# EAGLE schematic pj8 (EAGLE 7.3.2)
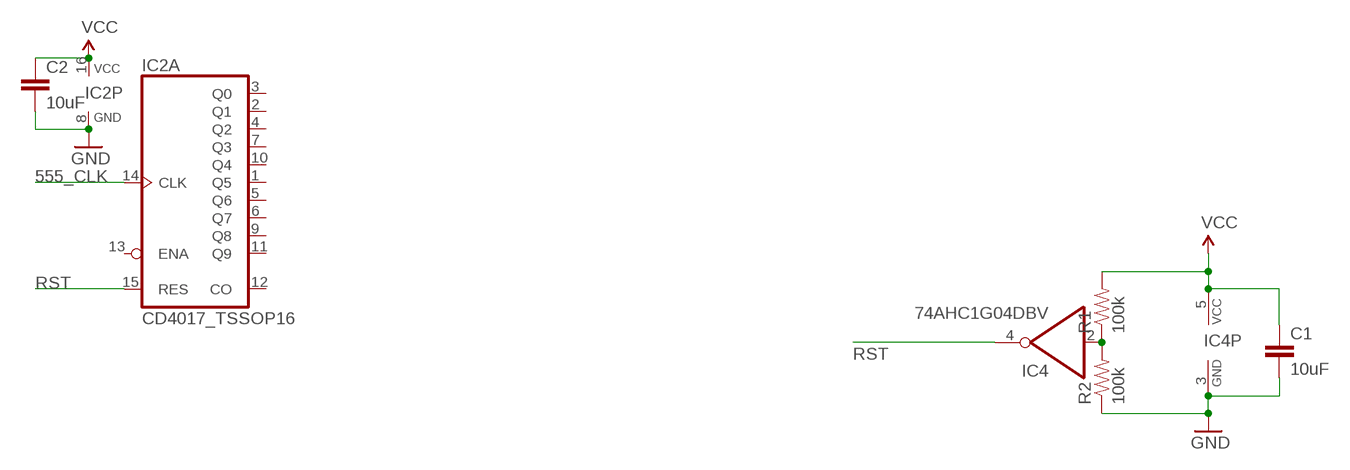
[diagram p0: schematic, sheet 1]

## Parts
C1  10uF  10UF-6.3V-20%(0603)  [0603-CAP]
C2  10uF  10UF-6.3V-20%(0603)  [0603-CAP]
IC2  CD4017_TSSOP16  [TSSOP16]
IC4  74AHC1G04DBV  [SOT23-5]
R1  100k  100KOHM-1/10W-1%(0603)  [0603-RES]
R2  100k  100KOHM-1/10W-1%(0603)  [0603-RES]

## Nets
555_CLK: IC2.14(A:CLK)
GND: C1.2 C2.2 IC2.8(P:GND) IC4.3(GND) R2.1
N$3: IC4.2(I) R1.1 R2.2
RST: IC2.15(A:RES) IC4.4(O)
VCC: C1.1 C2.1 IC2.16(P:VCC) IC4.5(VCC) R1.2
Unconnected: IC2.1(A:Q5) IC2.2(A:Q1) IC2.3(A:Q0) IC2.4(A:Q2) IC2.5(A:Q6) IC2.6(A:Q7) IC2.7(A:Q3) IC2.9(A:Q8) IC2.10(A:Q4) IC2.11(A:Q9) IC2.12(A:CO) IC2.13(A:ENA)

## Library data of the parts
C1 C2 = SparkFun-Capacitors:10UF-6.3V-20%(0603): CAP-11015; PROD_ID: CAP-11015
IC2 = SparkFun-DigitalIC:CD4017
IC4 = 74xx-little-de:74*1G04: INVERTER Gate
R1 R2 = SparkFun-Resistors:100KOHM-1/10W-1%(0603): RES-07828; PROD_ID: RES-07828